# Altium schematic sheet Schematic.SchDoc
size A4; SheetNumber: 1; SheetTotal: 1
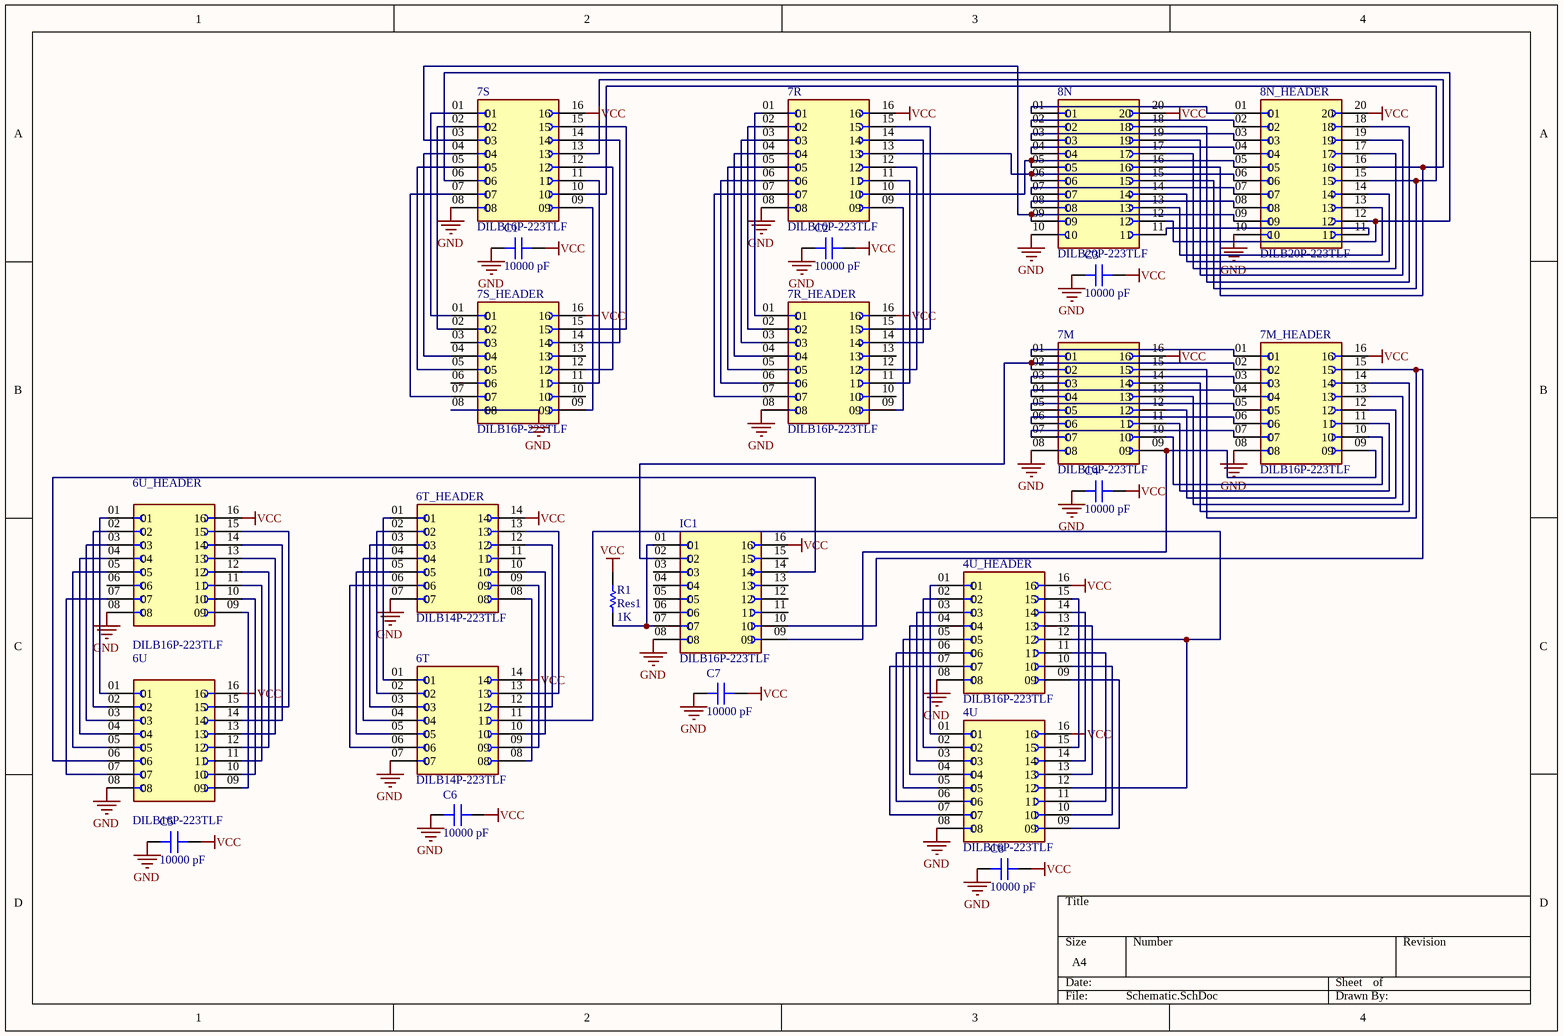
[diagram p0: Schematic.SchDoc]

## Parts
4U  DILB16P-223TLF  [AMPHENOL_DILB16P-223TLF]
4U_HEADER  DILB16P-223TLF  [AMPHENOL_DILB16P-223TLF]
6T  DILB14P-223TLF  [AMPHENOL_DILB14P-223TLF]
6T_HEADER  DILB14P-223TLF  [AMPHENOL_DILB14P-223TLF]
6U  DILB16P-223TLF  [AMPHENOL_DILB16P-223TLF]
6U_HEADER  DILB16P-223TLF  [AMPHENOL_DILB16P-223TLF]
7M  DILB16P-223TLF  [AMPHENOL_DILB16P-223TLF]
7M_HEADER  DILB16P-223TLF  [AMPHENOL_DILB16P-223TLF]
7R  DILB16P-223TLF  [AMPHENOL_DILB16P-223TLF]
7R_HEADER  DILB16P-223TLF  [AMPHENOL_DILB16P-223TLF]
7S  DILB16P-223TLF  [AMPHENOL_DILB16P-223TLF]
7S_HEADER  DILB16P-223TLF  [AMPHENOL_DILB16P-223TLF]
8N  DILB20P-223TLF  [AMPHENOL_DILB20P-223TLF]
8N_HEADER  DILB20P-223TLF  [AMPHENOL_DILB20P-223TLF]
C1  10000 pF  [CAP FILM 0805]
C2  10000 pF  [CAP FILM 0805]
C3  10000 pF  [CAP FILM 0805]
C4  10000 pF  [CAP FILM 0805]
C5  10000 pF  [CAP FILM 0805]
C6  10000 pF  [CAP FILM 0805]
C7  10000 pF  [CAP FILM 0805]
C8  10000 pF  [CAP FILM 0805]
IC1  DILB16P-223TLF  [AMPHENOL_DILB16P-223TLF]
R1  Res1  value 1K  [AXIAL-0.3]

## Nets
GND: 4U.08 4U_HEADER.08 6T.07 6T_HEADER.07 6U.08 6U_HEADER.08 7M.08 7M_HEADER.08 7R.08 7R_HEADER.08 7S.08 7S_HEADER.08 8N.10 8N_HEADER.10 C1.1 C2.1 C3.1 C4.1 C5.1 C6.1 C7.1 C8.1 IC1.08
VCC: 4U.16 4U_HEADER.16 6T.14 6T_HEADER.14 6U.16 6U_HEADER.16 7M.16 7M_HEADER.16 7R.16 7R_HEADER.16 7S.16 7S_HEADER.16 8N.20 8N_HEADER.20 C1.2 C2.2 C3.2 C4.2 C5.2 C6.2 C7.2 C8.2 IC1.16 R1.1
Net4U_01: 4U.01 4U_HEADER.01
Net4U_02: 4U.02 4U_HEADER.02
Net4U_03: 4U.03 4U_HEADER.03
Net4U_04: 4U.04 4U_HEADER.04
Net4U_05: 4U.05 4U_HEADER.05
Net4U_06: 4U.06 4U_HEADER.06
Net4U_07: 4U.07 4U_HEADER.07
Net4U_09: 4U.09 4U_HEADER.09
Net4U_10: 4U.10 4U_HEADER.10
Net4U_11: 4U.11 4U_HEADER.11
Net4U_12: 4U.12 4U_HEADER.12 6T.11
Net4U_13: 4U.13 4U_HEADER.13
Net4U_14: 4U.14 4U_HEADER.14
Net4U_15: 4U.15 4U_HEADER.15
Net6T_01: 6T.01 6T_HEADER.01
Net6T_02: 6T.02 6T_HEADER.02
Net6T_03: 6T.03 6T_HEADER.03
Net6T_04: 6T.04 6T_HEADER.04
Net6T_05: 6T.05 6T_HEADER.05
Net6T_06: 6T.06 6T_HEADER.06
Net6T_08: 6T.08 6T_HEADER.08
Net6T_09: 6T.09 6T_HEADER.09
Net6T_10: 6T.10 6T_HEADER.10
Net6T_12: 6T.12 6T_HEADER.12
Net6T_13: 6T.13 6T_HEADER.13
Net6U_01: 6U.01 6U_HEADER.01
Net6U_02: 6U.02 6U_HEADER.02
Net6U_03: 6U.03 6U_HEADER.03
Net6U_04: 6U.04 6U_HEADER.04
Net6U_05: 6U.05 6U_HEADER.05
Net6U_06: 6U.06 IC1.14
Net6U_07: 6U.07 6U_HEADER.07
Net6U_09: 6U.09 6U_HEADER.09
Net6U_10: 6U.10 6U_HEADER.10
Net6U_11: 6U.11 6U_HEADER.11
Net6U_12: 6U.12 6U_HEADER.12
Net6U_13: 6U.13 6U_HEADER.13
Net6U_14: 6U.14 6U_HEADER.14
Net6U_15: 6U.15 6U_HEADER.15
Net7M_01: 7M.01 7M_HEADER.01
Net7M_02: 7M.02 7M_HEADER.02 IC1.02
Net7M_03: 7M.03 7M_HEADER.03
Net7M_04: 7M.04 7M_HEADER.04
Net7M_05: 7M.05 7M_HEADER.05
Net7M_06: 7M.06 7M_HEADER.06
Net7M_07: 7M.07 7M_HEADER.07
Net7M_09: 7M.09 7M_HEADER.09 IC1.09
Net7M_10: 7M.10 7M_HEADER.10
Net7M_11: 7M.11 7M_HEADER.11
Net7M_12: 7M.12 7M_HEADER.12
Net7M_13: 7M.13 7M_HEADER.13
Net7M_14: 7M.14 7M_HEADER.14
Net7M_15: 7M.15 7M_HEADER.15 IC1.10
Net7R_01: 7R.01 7R_HEADER.01
Net7R_02: 7R.02 7R_HEADER.02
Net7R_03: 7R.03 7R_HEADER.03
Net7R_04: 7R.04 7R_HEADER.04
Net7R_05: 7R.05 7R_HEADER.05
Net7R_06: 7R.06 7R_HEADER.06
Net7R_07: 7R.07 7R_HEADER.07
Net7R_09: 7R.09 7R_HEADER.09
Net7R_10: 7R.10 8N.05 8N_HEADER.05
Net7R_11: 7R.11 7R_HEADER.11
Net7R_12: 7R.12 7R_HEADER.12
Net7R_13: 7R.13 8N.06 8N_HEADER.06
Net7R_14: 7R.14 7R_HEADER.14
Net7R_15: 7R.15 7R_HEADER.15
Net7S_01: 7S.01 7S_HEADER.01
Net7S_02: 7S.02 7S_HEADER.02
Net7S_03: 7S.03 8N.09 8N_HEADER.09
Net7S_04: 7S.04 7S_HEADER.04
Net7S_05: 7S.05 7S_HEADER.05
Net7S_06: 7S.06 8N.12 8N_HEADER.12
Net7S_07: 7S.07 7S_HEADER.07
Net7S_09: 7S.09 7S_HEADER.09
Net7S_10: 7S.10 8N.15 8N_HEADER.15
Net7S_11: 7S.11 7S_HEADER.11
Net7S_12: 7S.12 7S_HEADER.12
Net7S_13: 7S.13 8N.16 8N_HEADER.16
Net7S_14: 7S.14 7S_HEADER.14
Net7S_15: 7S.15 7S_HEADER.15
Net8N_01: 8N.01 8N_HEADER.01
Net8N_02: 8N.02 8N_HEADER.02
Net8N_03: 8N.03 8N_HEADER.03
Net8N_04: 8N.04 8N_HEADER.04
Net8N_07: 8N.07 8N_HEADER.07
Net8N_08: 8N.08 8N_HEADER.08
Net8N_11: 8N.11 8N_HEADER.11
Net8N_13: 8N.13 8N_HEADER.13
Net8N_14: 8N.14 8N_HEADER.14
Net8N_17: 8N.17 8N_HEADER.17
Net8N_18: 8N.18 8N_HEADER.18
Net8N_19: 8N.19 8N_HEADER.19
NetIC1_01: IC1.01 IC1.07 R1.2

Not connected (* = marked no-connect by the designer): 6T_HEADER 11; 6U_HEADER 06; 7R_HEADER 10 13; 7S_HEADER 03 06 10 13; IC1 03 04 05 06 11 12 13 15

## Library data of the parts
4U 4U_HEADER 6U 6U_HEADER 7M 7M_HEADER 7R 7R_HEADER 7S 7S_HEADER IC1 = DILB16P-223TLF: DIP Socket, Stamped and Formed; MF: Amphenol ICC (FCI); Check_prices: https://www.snapeda.com/parts/DILB16P-223TLF/Amphenol+FCI/view-part/?ref=eda; Package: None; Price: None; Value: *; MP: DILB16P-223TLF; SnapEDA_Link: https://www.snapeda.com/parts/DILB16P-223TLF/Amphenol+FCI/view-part/?ref=snap; Availability: In Stock
8N 8N_HEADER = DILB20P-223TLF: 20 (2 x 10) Pos DIP, 0.3 (7.62mm) Row Spacing Socket Tin Through Hole; MF: FCI; Purchase-URL: https://pricing.snapeda.com/search/part/DILB20P-223TLF/?ref=eda; Package: None; Check_prices: https://www.snapeda.com/parts/DILB20P-223TLF/Amphenol+FCI/view-part/?ref=eda; Price: None; SnapEDA_Link: https://www.snapeda.com/parts/DILB20P-223TLF/Amphenol+FCI/view-part/?ref=snap; Availability: In Stock; MP: DILB20P-223TLF; Value: *
C1-C8 = ECH-U1C103GX5: CAP FILM 10000PF 2% 16VDC 0805; Manufacturer: Panasonic Electronic Components; Dielectric Material: Polyphenylene Sulfide (PPS), Metallized - Stacked; Voltage Rating - AC: 11V; Voltage Rating - DC: 16V; Part Number: ECH-U1C103GX5; Capacitance: 10000 pF; Applications: General Purpose; ComponentLink1Description: Datasheet; ComponentLink1URL: http://industrial.panasonic.com/www-cgi/jvcr13pz.cgi?E+PZ+3+ABD0013+ECHU1C103GX5+7+WW; ComponentLink2Description: DigiKey Link; ComponentLink2URL: https://www.digikey.com/en/products/detail/panasonic-electronic-components/ECH-U1C103GX5/353626; Device Package: 0805 (2012 Metric); Height - Seated (Max): 0.051" (1.30mm); LastUpdated: 2024-02-08 9:45:33 PM; Lifecycle Status: Active; Minimum Order: 1; Mounting Type: Surface Mount; Operating Temperature: -55°C ~ 125°C; Package / Case: 0805 (2012 Metric); Packaging: TapeAndReel; Part Status: Active; Price: 0.13; Series: ECH-U(X); Size / Dimension: 0.079" L x 0.049" W (2.00mm x 1.25mm); Supplier 1: DigiKey; Supplier Part Number 1: PCF1177CT-ND; Termination: Solder Pads; Tolerance: ±2%; Value: 10000 pF
R1 = Res1: Resistor; Published: 8-Jun-2000; LatestRevisionDate: 17-Jul-2002; LatestRevisionNote: Re-released for DXP Platform.; PackageReference: AXIAL-0.3; Publisher: Altium Limited; PackageDescription: Axial Device, Thru-Hole; 2 Leads; 0.3 in Pin Spacing
6T 6T_HEADER = DILB14P-223TLF: Price: None; MP: DILB14P-223TLF; Availability: Unavailable; Value: *; Package: None